# Altium schematic sheet 6-User IO.SchDoc: User I/O
size B; CompanyName: NGRF; Address1: 2130 Howard Drive W; Address2: North Mankato, MN 56003; Address3: www.nextgenrf.com; Revision: 2; SheetNumber: 6; SheetTotal: 7; ProjName: BytePipe X9002_HDK
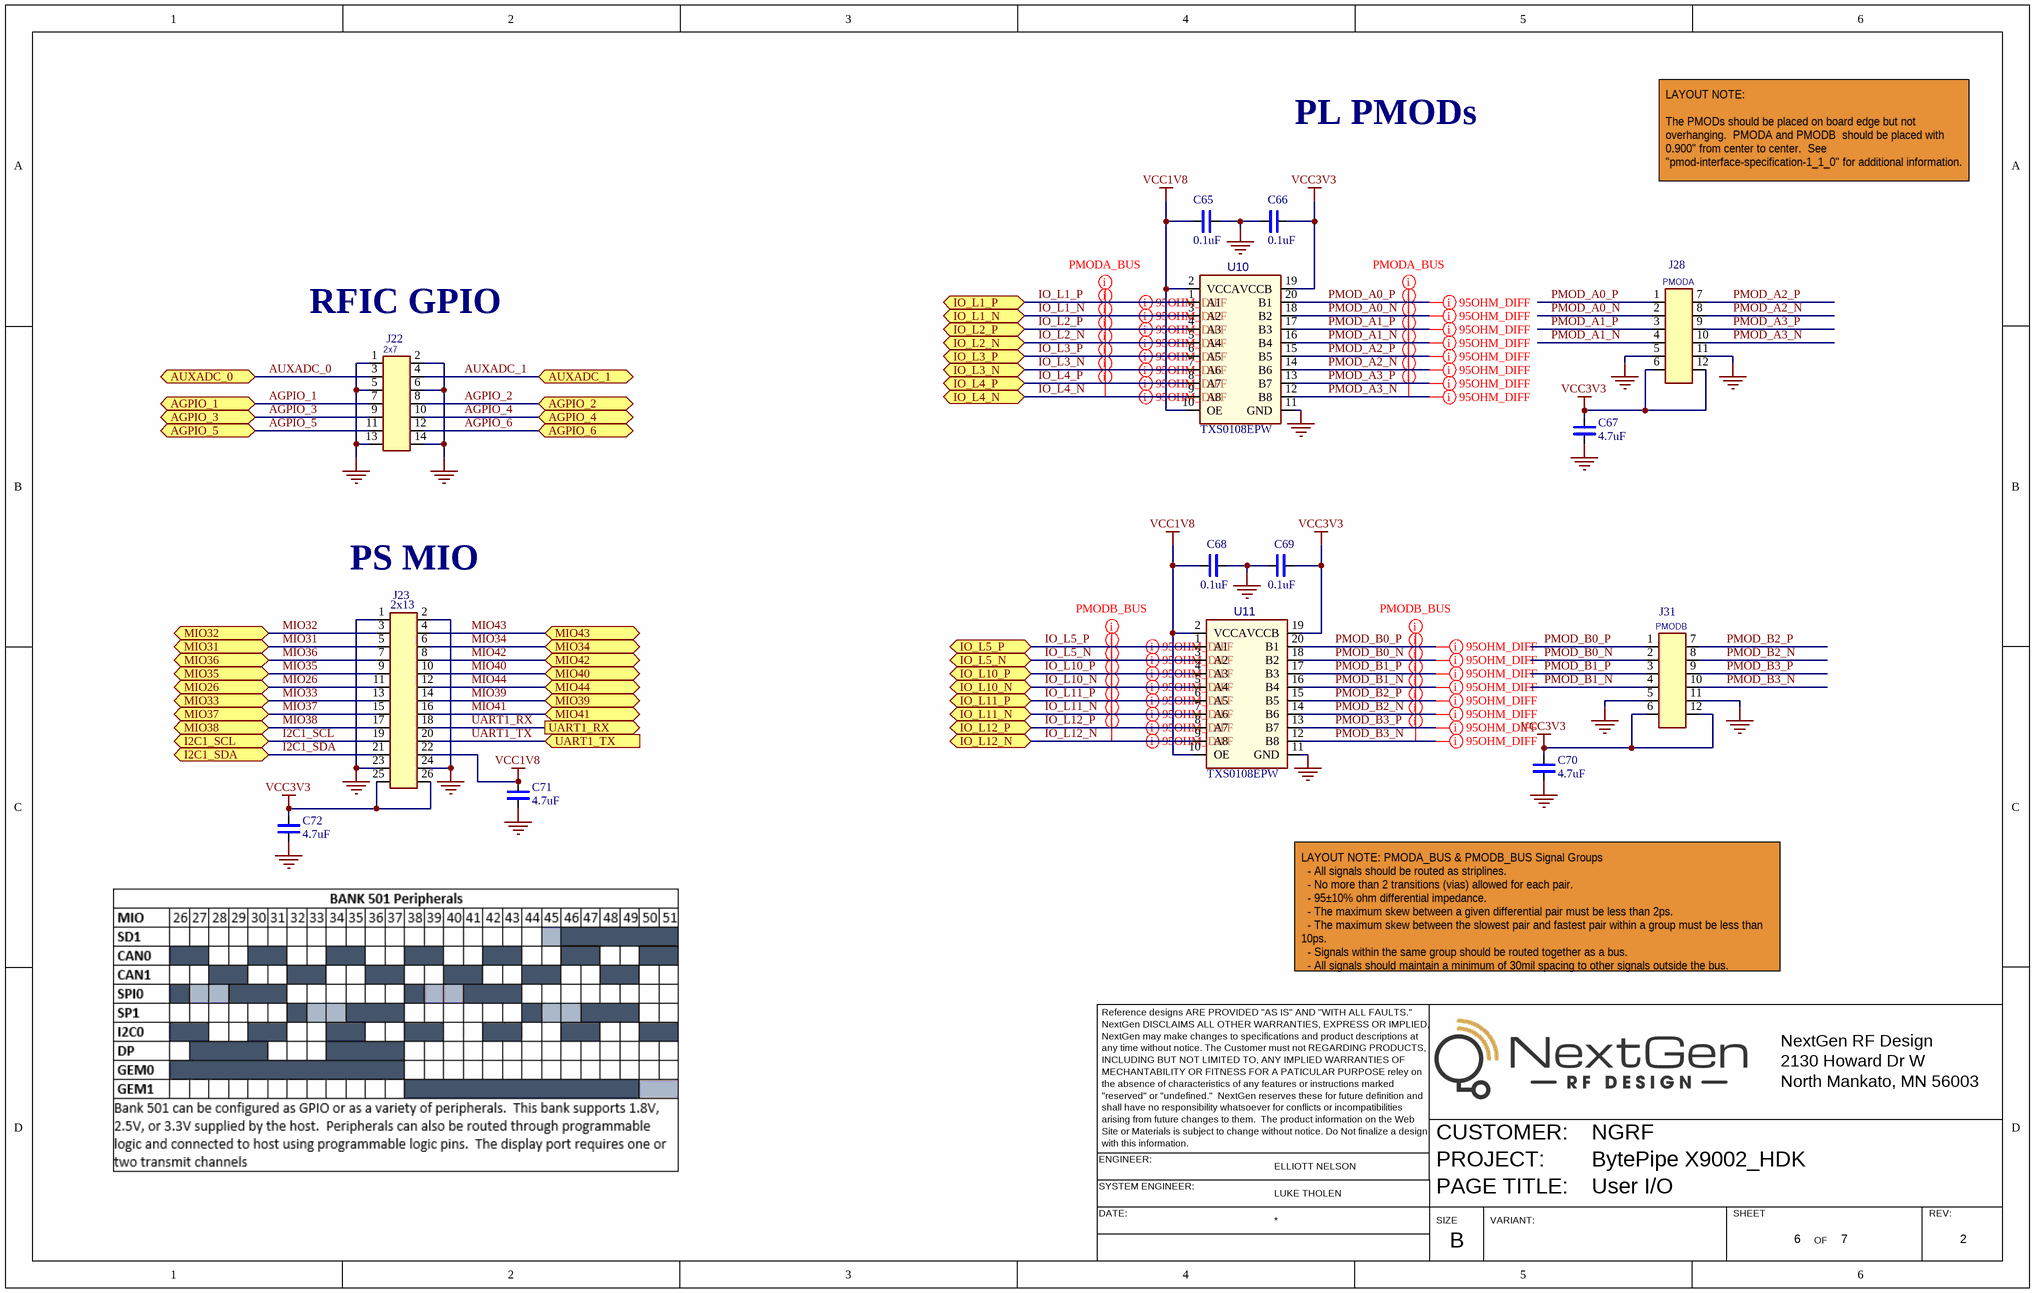
[diagram p0: 6-User IO.SchDoc]

## Parts
C65  value 0.1uF  [SM/0402/CAP]  (hidden comment: CAP_CERAMIC_0402)
C66  value 0.1uF  [SM/0402/CAP]  (hidden comment: CAP_CERAMIC_0402)
C67  value 4.7uF  [SM/0402/CAP]  (hidden comment: CAP_CERAMIC_0402)
C68  value 0.1uF  [SM/0402/CAP]  (hidden comment: CAP_CERAMIC_0402)
C69  value 0.1uF  [SM/0402/CAP]  (hidden comment: CAP_CERAMIC_0402)
C70  value 4.7uF  [SM/0402/CAP]  (hidden comment: CAP_CERAMIC_0402)
C71  value 4.7uF  [SM/0402/CAP]  (hidden comment: CAP_CERAMIC_0402)
C72  value 4.7uF  [SM/0402/CAP]  (hidden comment: CAP_CERAMIC_0402)
J22  value 2x7  [CON/100SP/2X7P/VT/038_A]  (hidden comment: CON_100SP_2X7P_VT)
J23  value 2x13  [CON/100SP/2X13P/038_A]  (hidden comment: CON_100SP_2X13P_VERT)
J28  value PMODA  [CON/SAMTEC/SSW/2X6/RA_A/PMOD]  (hidden comment: CON_100SP_2X6P_RA_PMOD)
J31  value PMODB  [CON/SAMTEC/SSW/2X6/RA_A/PMOD]  (hidden comment: CON_100SP_2X6P_RA_PMOD)
U10  value TXS0108EPW  [SM/TSSOP20_6.5X6.4MM]  (hidden comment: IC_TXS0108_TSSOP-20)
U11  value TXS0108EPW  [SM/TSSOP20_6.5X6.4MM]  (hidden comment: IC_TXS0108_TSSOP-20)

## Ports
AGPIO_1 (bidir), AGPIO_2 (bidir), AGPIO_3 (bidir), AGPIO_4 (bidir), AGPIO_5 (bidir), AGPIO_6 (bidir), AUXADC_0 (bidir), AUXADC_1 (bidir), I2C1_SCL (bidir), I2C1_SDA (bidir), IO_L1_N (bidir), IO_L1_P (bidir), IO_L2_N (bidir), IO_L2_P (bidir), IO_L3_N (bidir), IO_L3_P (bidir), IO_L4_N (bidir), IO_L4_P (bidir), IO_L5_N (bidir), IO_L5_P (bidir), IO_L10_N (bidir), IO_L10_P (bidir), IO_L11_N (bidir), IO_L11_P (bidir), IO_L12_N (bidir), IO_L12_P (bidir), MIO26 (bidir), MIO31 (bidir), MIO32 (bidir), MIO33 (bidir), MIO34 (bidir), MIO35 (bidir), MIO36 (bidir), MIO37 (bidir), MIO38 (bidir), MIO39 (bidir), MIO40 (bidir), MIO41 (bidir), MIO42 (bidir), MIO43 (bidir), MIO44 (bidir), UART1_RX (out), UART1_TX (in)

## Nets
GND: C65.2(N2) C66.1(N1) C67.2(N2) C68.2(N2) C69.1(N1) C70.2(N2) C71.2(N2) C72.2(N2) J22.1(N1) J22.2(N2) J22.5(N5) J22.6(N6) J22.13(N13) J22.14(N14) J23.1(N1) J23.2(N2) J23.23(N23) J23.24(N24) J28.5(N5) J28.11(N11) J31.5(N5) J31.11(N11) U10.11(GND) U11.11(GND)
VCC1V8: C65.1(N1) C68.1(N1) C71.1(N1) J23.22(N22) U10.2(VCCA) U10.10(OE) U11.2(VCCA) U11.10(OE)
VCC3V3: C66.2(N2) C67.1(N1) C69.2(N2) C70.1(N1) C72.1(N1) J23.25(N25) J23.26(N26) J28.6(N6) J28.12(N12) J31.6(N6) J31.12(N12) U10.19(VCCB) U11.19(VCCB)
AGPIO_1: J22.7(N7) ; port AGPIO_1
AGPIO_2: J22.8(N8) ; port AGPIO_2
AGPIO_3: J22.9(N9) ; port AGPIO_3
AGPIO_4: J22.10(N10) ; port AGPIO_4
AGPIO_5: J22.11(N11) ; port AGPIO_5
AGPIO_6: J22.12(N12) ; port AGPIO_6
AUXADC_0: J22.3(N3) ; port AUXADC_0
AUXADC_1: J22.4(N4) ; port AUXADC_1
I2C1_SCL: J23.19(N19) ; port I2C1_SCL
I2C1_SDA: J23.21(N21) ; port I2C1_SDA
IO_L1_N: U10.3(A2) ; port IO_L1_N
IO_L1_P: U10.1(A1) ; port IO_L1_P
IO_L2_N: U10.5(A4) ; port IO_L2_N
IO_L2_P: U10.4(A3) ; port IO_L2_P
IO_L3_N: U10.7(A6) ; port IO_L3_N
IO_L3_P: U10.6(A5) ; port IO_L3_P
IO_L4_N: U10.9(A8) ; port IO_L4_N
IO_L4_P: U10.8(A7) ; port IO_L4_P
IO_L5_N: U11.3(A2) ; port IO_L5_N
IO_L5_P: U11.1(A1) ; port IO_L5_P
IO_L10_N: U11.5(A4) ; port IO_L10_N
IO_L10_P: U11.4(A3) ; port IO_L10_P
IO_L11_N: U11.7(A6) ; port IO_L11_N
IO_L11_P: U11.6(A5) ; port IO_L11_P
IO_L12_N: U11.9(A8) ; port IO_L12_N
IO_L12_P: U11.8(A7) ; port IO_L12_P
MIO26: J23.11(N11) ; port MIO26
MIO31: J23.5(N5) ; port MIO31
MIO32: J23.3(N3) ; port MIO32
MIO33: J23.13(N13) ; port MIO33
MIO34: J23.6(N6) ; port MIO34
MIO35: J23.9(N9) ; port MIO35
MIO36: J23.7(N7) ; port MIO36
MIO37: J23.15(N15) ; port MIO37
MIO38: J23.17(N17) ; port MIO38
MIO39: J23.14(N14) ; port MIO39
MIO40: J23.10(N10) ; port MIO40
MIO41: J23.16(N16) ; port MIO41
MIO42: J23.8(N8) ; port MIO42
MIO43: J23.4(N4) ; port MIO43
MIO44: J23.12(N12) ; port MIO44
PMOD_A0_N: J28.2(N2) U10.18(B2)
PMOD_A0_P: J28.1(N1) U10.20(B1)
PMOD_A1_N: J28.4(N4) U10.16(B4)
PMOD_A1_P: J28.3(N3) U10.17(B3)
PMOD_A2_N: J28.8(N8) U10.14(B6)
PMOD_A2_P: J28.7(N7) U10.15(B5)
PMOD_A3_N: J28.10(N10) U10.12(B8)
PMOD_A3_P: J28.9(N9) U10.13(B7)
PMOD_B0_N: J31.2(N2) U11.18(B2)
PMOD_B0_P: J31.1(N1) U11.20(B1)
PMOD_B1_N: J31.4(N4) U11.16(B4)
PMOD_B1_P: J31.3(N3) U11.17(B3)
PMOD_B2_N: J31.8(N8) U11.14(B6)
PMOD_B2_P: J31.7(N7) U11.15(B5)
PMOD_B3_N: J31.10(N10) U11.12(B8)
PMOD_B3_P: J31.9(N9) U11.13(B7)
UART1_RX: J23.18(N18) ; port UART1_RX
UART1_TX: J23.20(N20) ; port UART1_TX

## Layout directives
net class PMODA_BUS: IO_L1_N, IO_L1_P, IO_L2_N, IO_L2_P, IO_L3_N, IO_L3_P, IO_L4_N, IO_L4_P, PMOD_A0_N, PMOD_A0_P, PMOD_A1_N, PMOD_A1_P, PMOD_A2_N, PMOD_A2_P, PMOD_A3_N, PMOD_A3_P
differential pair; Impedance: 90 Ohms; differential pair class 95OHM_DIFF: IO_L1_N, IO_L1_P, IO_L2_N, IO_L2_P, IO_L3_N, IO_L3_P, IO_L4_N, IO_L4_P, IO_L5_N, IO_L5_P, IO_L10_N, IO_L10_P, IO_L11_N, IO_L11_P, IO_L12_N, IO_L12_P, PMOD_A0_N, PMOD_A0_P, PMOD_A1_N, PMOD_A1_P, PMOD_A2_N, PMOD_A2_P, PMOD_A3_N, PMOD_A3_P, PMOD_B0_N, PMOD_B0_P, PMOD_B1_N, PMOD_B1_P, PMOD_B2_N, PMOD_B2_P, PMOD_B3_N, PMOD_B3_P
net class PMODB_BUS: IO_L5_N, IO_L5_P, IO_L10_N, IO_L10_P, IO_L11_N, IO_L11_P, IO_L12_N, IO_L12_P, PMOD_B0_N, PMOD_B0_P, PMOD_B1_N, PMOD_B1_P, PMOD_B2_N, PMOD_B2_P, PMOD_B3_N, PMOD_B3_P

## Notes on the sheet
- PL PMODs
- LAYOUT NOTE:
  The PMODs should be placed on board edge but not overhanging.  PMODA and PMODB  should be placed with 0.900" from center to center.  See "pmod-interface-specification-1_1_0" for additional information.
- (near J22) RFIC GPIO
- (near J23) PS MIO
- LAYOUT NOTE: PMODA_BUS & PMODB_BUS Signal Groups
  - All signals should be routed as striplines.
  - No more than 2 transitions (vias) allowed for each pair.
  - 95±10% ohm differential impedance.
  - The maximum skew between a given differential pair must be less than 2ps.
  - The maximum skew between the slowest pair and fastest pair within a group must be less than 10ps.
  - Signals within the same group should be routed together as a bus.
  - All signals should maintain a minimum of 30mil spacing to other signals outside the bus.
- Reference designs ARE PROVIDED "AS IS" AND "WITH ALL FAULTS."
- NextGen DISCLAIMS ALL OTHER WARRANTIES, EXPRESS OR IMPLIED,
- NextGen may make changes to specifications and product descriptions at
- NextGen RF Design
- any time without notice. The Customer must not REGARDING PRODUCTS,
- INCLUDING BUT NOT LIMITED TO, ANY IMPLIED WARRANTIES OF
- MECHANTABILITY OR FITNESS FOR A PATICULAR PURPOSE reley on
- "reserved" or "undefined."  NextGen reserves these for future definition and
- the absence of characteristics of any features or instructions marked
- shall have no responsibility whatsoever for conflicts or incompatibilities
- 2130 Howard Dr W
- North Mankato, MN 56003
- ENGINEER:
- Site or Materials is subject to change without notice. Do Not finalize a design
- with this information.
- arising from future changes to them.  The product information on the Web
- ELLIOTT NELSON
- CUSTOMER:
- PROJECT:
- SYSTEM ENGINEER:
- DATE:
- LUKE THOLEN
- SIZE
- PAGE TITLE:
- VARIANT:
- SHEET
- OF
- REV:
- B

## Library data of the parts
C65 C66 C68 C69 = CAP_CERAMIC_0402: CAP CER 0.1UF 25V X7R 0402; TOL: ±10%; OEM#: CL05B104KA5NNNC; OEM NAME: Samsung; VOLT: 25V
C67 C70-C72 = CAP_CERAMIC_0402: CAP CER 4.7UF 10V X5R 0402; TOL: ±20%; OEM#: CL05A475MP5NRNC; OEM NAME: Samsung; VOLT: 10V
J22 = CON_100SP_2X7P_VT: Connector Header Through Hole 14 position 0.100" (2.54mm); OEM#: 2011-2X07TSB; OEM NAME: Harwin Inc.
J23 = CON_100SP_2X13P_VERT: PIN HEADER, DOUBLE ROW 26 PIN, S; OEM#: M20-9981345; OEM NAME: Harwin Inc.
J28 J31 = CON_100SP_2X6P_RA_PMOD: Header, 100 mil, 2x6, Right Angle, PMOD pin out.; OEM#: SSW-106-02-T-D-RA; OEM NAME: SAMTEC
U10 U11 = IC_TXS0108_TSSOP-20: IC TRNSLTR BIDIRECTIONAL 20VQFN; OEM NAME: Texas Instruments; OEM#: TXS0108EPW